# EAGLE design LoRaNow_v0 (EAGLE 9.4.0)
LoRaNow Board V0 This board was design to make easier to connect the Arduino Pro Mini and the LoRa module and runs with 2 AA batteries.
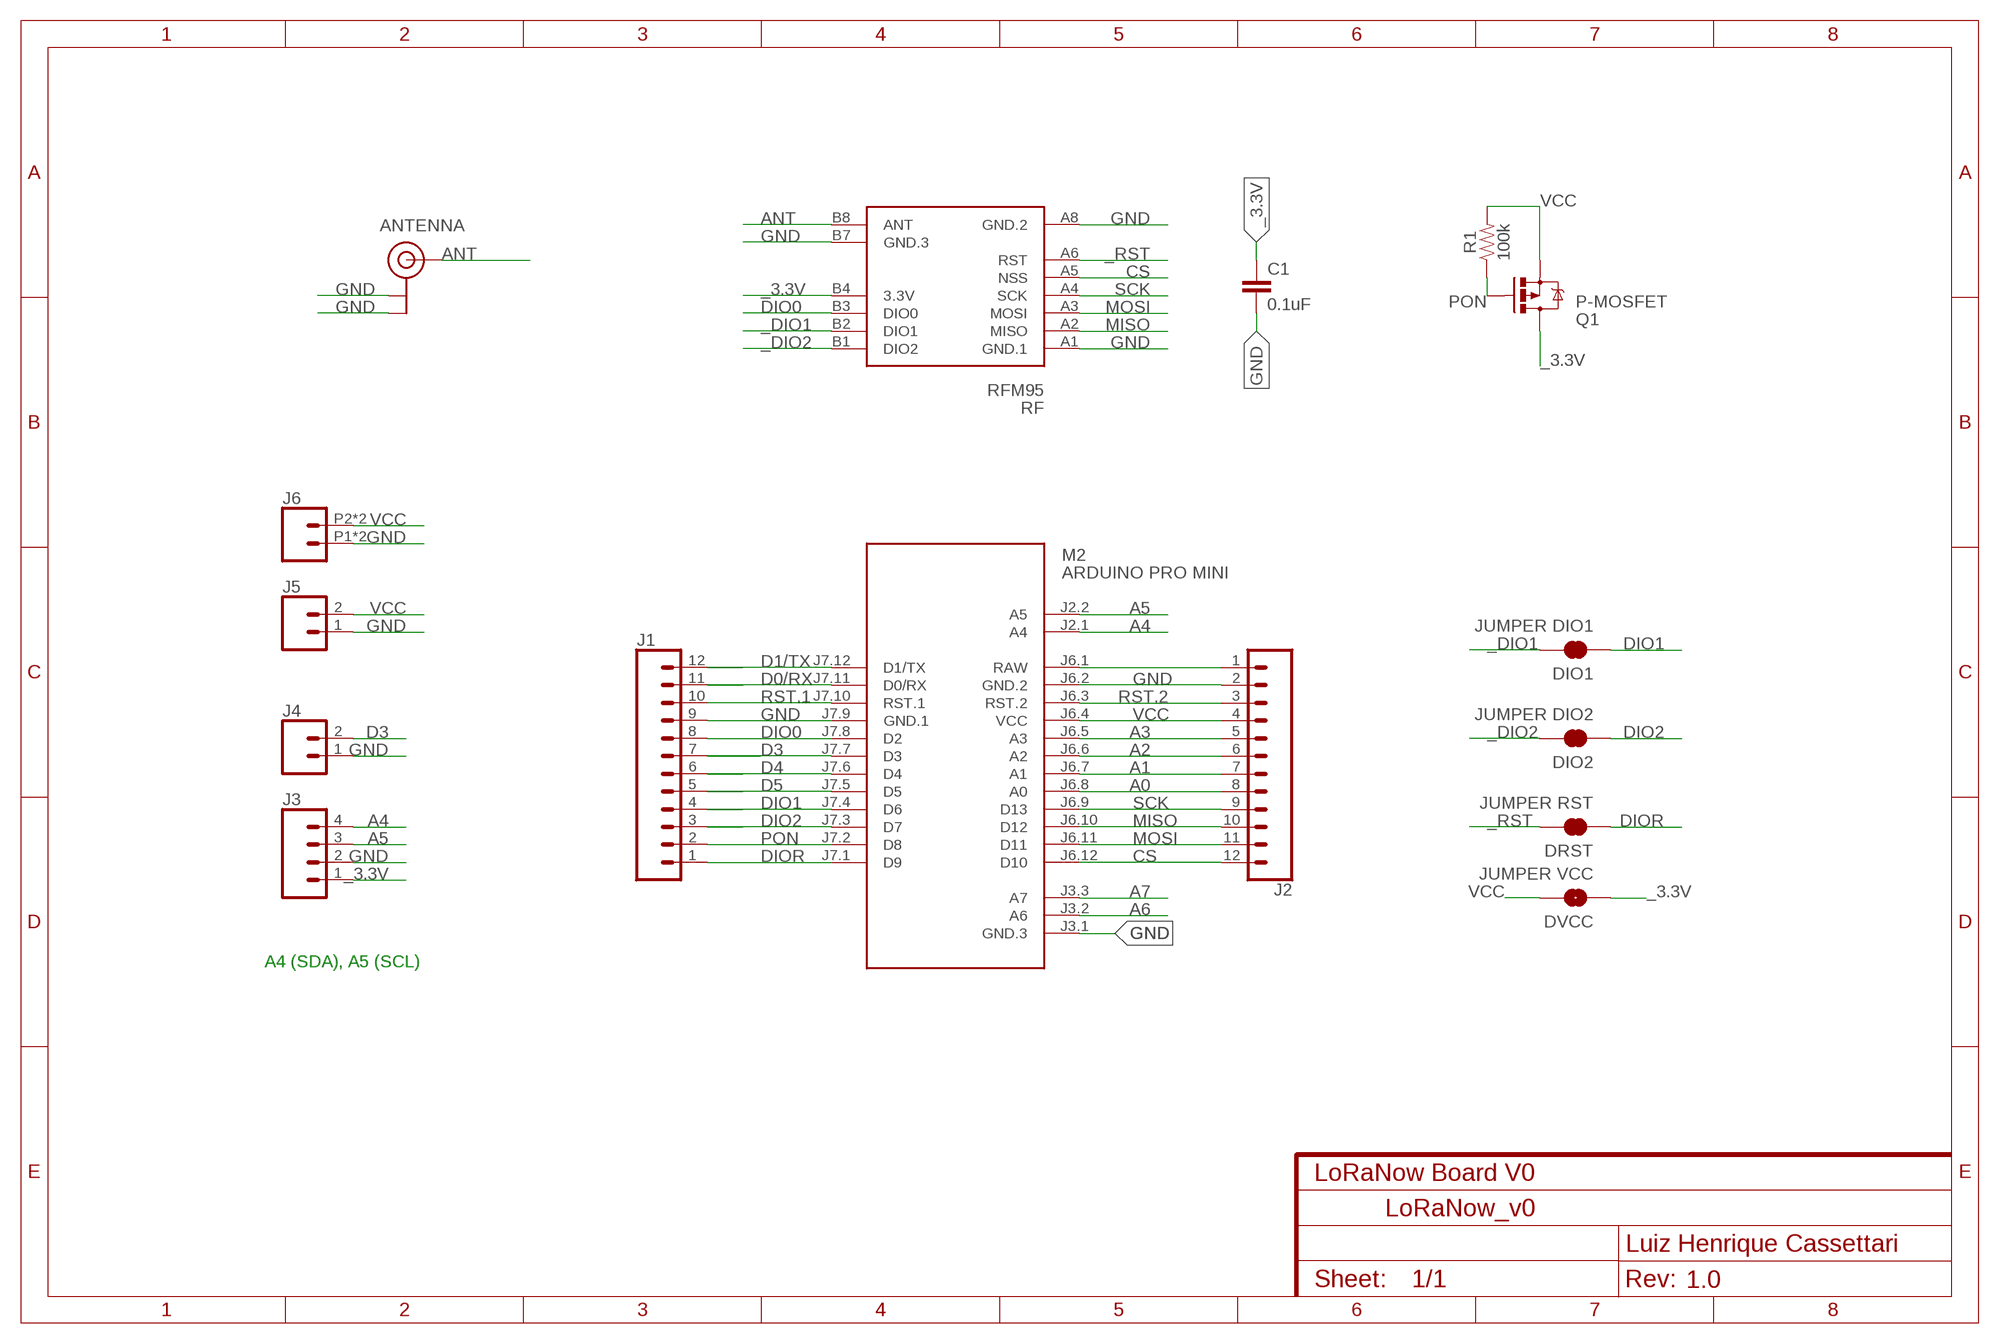
[diagram p0: schematic, sheet 1]
NAME (FRAME-A4L): CNAME: LoRaNow Board V0; CREVISION: 1.0; DESIGNER: Luiz Henrique Cassettari

## Parts
ANTENNA  U.FLU.FL2  [U.FL_2]
C1  0.1uF  C-EUC0603K  [C0603K]
DIO1  JUMPER DIO1  JUMPER-SMT_2_NC_TRACE_NO-SILK  [SMT-JUMPER_2_NC_TRACE_NO-SILK]
DIO2  JUMPER DIO2  JUMPER-SMT_2_NC_TRACE_NO-SILK  [SMT-JUMPER_2_NC_TRACE_NO-SILK]
DRST  JUMPER RST  JUMPER-SMT_2_NC_TRACE_NO-SILK  [SMT-JUMPER_2_NC_TRACE_NO-SILK]
DVCC  JUMPER VCC  JUMPER-SMT_2_NO_NO-SILK  [SMT-JUMPER_2_NO_NO-SILK]
J1  CONN_12NO_SILK  [1X12_NO_SILK]
J2  CONN_12NO_SILK  [1X12_NO_SILK]
J3  CONN_041X04_NO_SILK  [1X04_NO_SILK]
J4  CONN_021X02_NO_SILK  [1X02_NO_SILK]
J5  CONN_021X02_NO_SILK  [1X02_NO_SILK]
J6  CONN_02SMALL_POKEHOME  [1X02_POKEHOME]
M2  ARDUINO PRO MINI  ARDUINO-PRO-MINI-#NP2  [ARDUINO-PRO-MINI#NP#2]
Q1  P-MOSFET  MOSFET-PCHANNELSMD  [SOT23-3]
R1  100k  100KOHM-0603-1/10W-1%  [0603]
RF  RFM95  WIRELESS-LORA-RFM95W-LORANOW  [WIRELESS-LORA-RFM95W#SMD#2]

## Nets
_3.3V: C1.1 DVCC.1 J3.1 Q1.3(D) RF.B4(3.3V)
_DIO1: DIO1.2 RF.B2(DIO1)
_DIO2: DIO2.2 RF.B1(DIO2)
_RST: DRST.2 RF.A6(RST)
A0: J2.8 M2.J6.8(A0)
A1: J2.7 M2.J6.7(A1)
A2: J2.6 M2.J6.6(A2)
A3: J2.5 M2.J6.5(A3)
A4: J3.4 M2.J2.1(A4)
A5: J3.3 M2.J2.2(A5)
A6: M2.J3.2(A6)
A7: M2.J3.3(A7)
ANT: ANTENNA.FEED(SIGNAL) ANTENNA.FEED.P(SIGNAL) RF.B8(ANT)
CS: J2.12 M2.J6.12(D10) RF.A5(NSS)
D0/RX: J1.11 M2.J7.11(D0/RX)
D1/TX: J1.12 M2.J7.12(D1/TX)
D3: J1.7 J4.2 M2.J7.7(D3)
D4: J1.6 M2.J7.6(D4)
D5: J1.5 M2.J7.5(D5)
DIO0: J1.8 M2.J7.8(D2) RF.B3(DIO0)
DIO1: DIO1.1 J1.4 M2.J7.4(D6)
DIO2: DIO2.1 J1.3 M2.J7.3(D7)
DIOR: DRST.1 J1.1 M2.J7.1(D9)
GND: ANTENNA.1(GND) ANTENNA.2(GND) ANTENNA.3(GND) ANTENNA.4(GND) ANTENNA.5(GND) ANTENNA.6(GND) C1.2 J1.9 J2.2 J3.2 J4.1 J5.1 J6.P1 J6.P3 M2.J3.1(GND.3) M2.J6.2(GND.2) M2.J7.9(GND.1) RF.A1(GND.1) RF.A8(GND.2) RF.B7(GND.3)
MISO: J2.10 M2.J6.10(D12) RF.A2(MISO)
MOSI: J2.11 M2.J6.11(D11) RF.A3(MOSI)
PON: J1.2 M2.J7.2(D8) Q1.1(G) R1.1
RAW: J2.1 M2.J6.1(RAW)
RST.1: J1.10 M2.J7.10(RST.1)
RST.2: J2.3 M2.J6.3(RST.2)
SCK: J2.9 M2.J6.9(D13) RF.A4(SCK)
VCC: DVCC.2 J2.4 J5.2 J6.P2 J6.P4 M2.J6.4(VCC) Q1.2(S) R1.2

## Notes on the sheet
- A4 (SDA), A5 (SCL)

## Library data of the parts
ANTENNA = SparkFun-Connectors:U.FL: SMD Antenna Connector - U.FL 2mm height, 3.0mm x 3.0mm receptacle size. SparkFun Products: SparkFun WiFi Shield - ESP8266 <https://www.sparkfun.com/products/13287> SparkFun ESP8266 Thing <https://www.sparkfun.com/products/13231> SparkFun MiniGen - Pro Mini Signal Generator Shield <https://www.sparkfun.com/products/11420>
C1 = rcl:C-EU: CAPACITOR, European symbol; SPICEPREFIX: C
DIO1 DIO2 DRST = SparkFun-Jumpers:JUMPER-SMT_2_NC_TRACE: Normally closed trace jumper This jumper has a trace between two pads so it's normally closed (NC). Use a razor knife to open the connection. For best results follow the IPC guidelines for cutting traces: Cutout at least 0.063 mm (0.005 in). Remove all loose material to clean up the cut area. Seal the cut with an approved epoxy. Reapply solder to reclose the connection.
DVCC = SparkFun-Jumpers:JUMPER-SMT_2_NO: Normally open jumper This jumper has two pads in close proximity to each other. Apply solder to close the connection. Round pads are easier to solder for beginners, but are a lot larger. SparkFun Product that uses the round pads: SparkFun EL Sequencer <https://www.sparkfun.com/products/12781>
J1 J2 = SparkFun-Connectors:CONN_12: Multi connection point. Often used as Generic Header-pin footprint for 0.1 inch spaced/style header connections On any of the 0.1 inch spaced packages, you can populate with these: Break Away Headers - Straight <https://www.sparkfun.com/products/116> (PRT-00116) Break Away Male Headers - Right Angle <https://www.sparkfun.com/products/553> (PRT-00553) Female Headers <https://www.sparkfun.com/products/115> (PRT-00115) Break Away Headers - Machine Pin <https://www.sparkfun.com/products/117> (PRT-00117) Break Away Female Headers - Swiss Machine Pin <https://www.sparkfun.com/products/743> (PRT-00743) For SCREWTERMINALS and SPRING TERMINALS visit here: Screw Terimnals on SparkFun.com <https://www.sparkfun.com/search/results?term=Screw+Terminals> (5mm/3.5mm/2.54mm spacing) This device is also useful as a general connection point to wire up your design to another part of your project. Our various solder wires solder well into these plated through hole pads. Hook-Up Wire - Assortment (Stranded, 22 AWG) <https://www.sparkfun.com/products/11375> (PRT-11375) Hook-Up Wire - Assortment (Solid Core, 22 AWG) <https://www.sparkfun.com/products/11367> (PRT-11367) View the entire wire category on our website here <https://www.sparkfun.com/categories/141> Special notes: Molex polarized connector foot print use with SKU : PRT-08231 with associated crimp pins and housings. 1MM SMD Version SKU: PRT-10208 NOTES ON THE VARIANTS LOCK and LOCK_LONGPADS... This footprint was designed to help hold the alignment of a through-hole component (i.e. 6-pin header) while soldering it into place. You may notice that each hole has been shifted either up or down by 0.005 of an inch from it's more standard position (which is a perfectly straight line). This slight alteration caused the pins (the squares in the middle) to touch the edges of the holes. Because they are alternating, it causes a "brace" to hold the component in place. 0.005 has proven to be the perfect amount of "off-center" position when using our standard breakaway headers. Although looks a little odd when you look at the bare footprint, once you have a header in there, the alteration is very hard to notice. Also,if you push a header all the way into place, it is covered up entirely on the bottom side.
J3 = SparkFun-Connectors:CONN_04: Multi connection point. Often used as Generic Header-pin footprint for 0.1 inch spaced/style header connections On any of the 0.1 inch spaced packages, you can populate with these: Break Away Headers - Straight <https://www.sparkfun.com/products/116> (PRT-00116) Break Away Male Headers - Right Angle <https://www.sparkfun.com/products/553> (PRT-00553) Female Headers <https://www.sparkfun.com/products/115> (PRT-00115) Break Away Headers - Machine Pin <https://www.sparkfun.com/products/117> (PRT-00117) Break Away Female Headers - Swiss Machine Pin <https://www.sparkfun.com/products/743> (PRT-00743) For SCREWTERMINALS and SPRING TERMINALS visit here: Screw Terimnals on SparkFun.com <https://www.sparkfun.com/search/results?term=Screw+Terminals> (5mm/3.5mm/2.54mm spacing) This device is also useful as a general connection point to wire up your design to another part of your project. Our various solder wires solder well into these plated through hole pads. Hook-Up Wire - Assortment (Stranded, 22 AWG) <https://www.sparkfun.com/products/11375> (PRT-11375) Hook-Up Wire - Assortment (Solid Core, 22 AWG) <https://www.sparkfun.com/products/11367> (PRT-11367) View the entire wire category on our website here <https://www.sparkfun.com/categories/141> Special notes: Molex polarized connector foot print use with SKU : PRT-08231 with associated crimp pins and housings. 1MM SMD Version SKU: PRT-10208; PROD_ID: CONN-09696
J4 J5 = SparkFun-Connectors:CONN_02: Multi connection point. Often used as Generic Header-pin footprint for 0.1 inch spaced/style header connections On any of the 0.1 inch spaced packages, you can populate with these: Break Away Headers - Straight <https://www.sparkfun.com/products/116> (PRT-00116) Break Away Male Headers - Right Angle <https://www.sparkfun.com/products/553> (PRT-00553) Female Headers <https://www.sparkfun.com/products/115> (PRT-00115) Break Away Headers - Machine Pin <https://www.sparkfun.com/products/117> (PRT-00117) Break Away Female Headers - Swiss Machine Pin <https://www.sparkfun.com/products/743> (PRT-00743) For SCREWTERMINALS and SPRING TERMINALS visit here: Screw Terimnals on SparkFun.com <https://www.sparkfun.com/search/results?term=Screw+Terminals> (5mm/3.5mm/2.54mm spacing) This device is also useful as a general connection point to wire up your design to another part of your project. Our various solder wires solder well into these plated through hole pads. Hook-Up Wire - Assortment (Stranded, 22 AWG) <https://www.sparkfun.com/products/11375> (PRT-11375) Hook-Up Wire - Assortment (Solid Core, 22 AWG) <https://www.sparkfun.com/products/11367> (PRT-11367) View the entire wire category on our website here <https://www.sparkfun.com/categories/141> Special notes: Molex polarized connector foot print use with: PRT-08233 with associated crimp pins and housings. 2.54_SCREWTERM for use with PRT-10571. 3.5mm Screw Terminal footprints for PRT-08084 5mm Screw Terminal footprints for use with PRT-08432
J6 = SparkFun-Connectors:CONN_02: Multi connection point. Often used as Generic Header-pin footprint for 0.1 inch spaced/style header connections On any of the 0.1 inch spaced packages, you can populate with these: Break Away Headers - Straight <https://www.sparkfun.com/products/116> (PRT-00116) Break Away Male Headers - Right Angle <https://www.sparkfun.com/products/553> (PRT-00553) Female Headers <https://www.sparkfun.com/products/115> (PRT-00115) Break Away Headers - Machine Pin <https://www.sparkfun.com/products/117> (PRT-00117) Break Away Female Headers - Swiss Machine Pin <https://www.sparkfun.com/products/743> (PRT-00743) For SCREWTERMINALS and SPRING TERMINALS visit here: Screw Terimnals on SparkFun.com <https://www.sparkfun.com/search/results?term=Screw+Terminals> (5mm/3.5mm/2.54mm spacing) This device is also useful as a general connection point to wire up your design to another part of your project. Our various solder wires solder well into these plated through hole pads. Hook-Up Wire - Assortment (Stranded, 22 AWG) <https://www.sparkfun.com/products/11375> (PRT-11375) Hook-Up Wire - Assortment (Solid Core, 22 AWG) <https://www.sparkfun.com/products/11367> (PRT-11367) View the entire wire category on our website here <https://www.sparkfun.com/categories/141> Special notes: Molex polarized connector foot print use with: PRT-08233 with associated crimp pins and housings. 2.54_SCREWTERM for use with PRT-10571. 3.5mm Screw Terminal footprints for PRT-08084 5mm Screw Terminal footprints for use with PRT-08432; PROD_ID: CONN-13512
M2 = diy-modules:ARDUINO-PRO-MINI-*#NP: Arduino Pro Mini (and compatible devices) without programming pads More details available here: https://www.arduino.cc/en/Main/ArduinoBoardProMini Click here to find device on ebay.com <http://www.ebay.com/sch/arduino+pro+mini>
Q1 = User-Submitted:MOSFET-PCHANNEL: Generic PMOSFET IRLML2244 - TRANS-11153 (SOT-23 -20V -4.3A) (1.Gate 2.Source 3.Drain) FQP27P06 - COM-10349 <http://www.sparkfun.com/products/10349> (TO-220 -60V -27A) (1.Gate 2.Source 3.Drain)
R1 = SparkFun-Resistors:100KOHM: 100kΩ resistor A resistor is a passive two-terminal electrical component that implements electrical resistance as a circuit element. Resistors act to reduce current flow, and, at the same time, act to lower voltage levels within circuits. - Wikipedia; PROD_ID: RES-07828
RF = diy-modules:WIRELESS-LORA-RFM95W-LORANOW: 868/915 MHz LoRa Radio Transceiver Module based on SX1276 chip Click here to find device on ebay.com <http://www.ebay.com/sch/RFM95W+transceiver>

## Net classes
0 default: clearance 0.205 mm

## Board
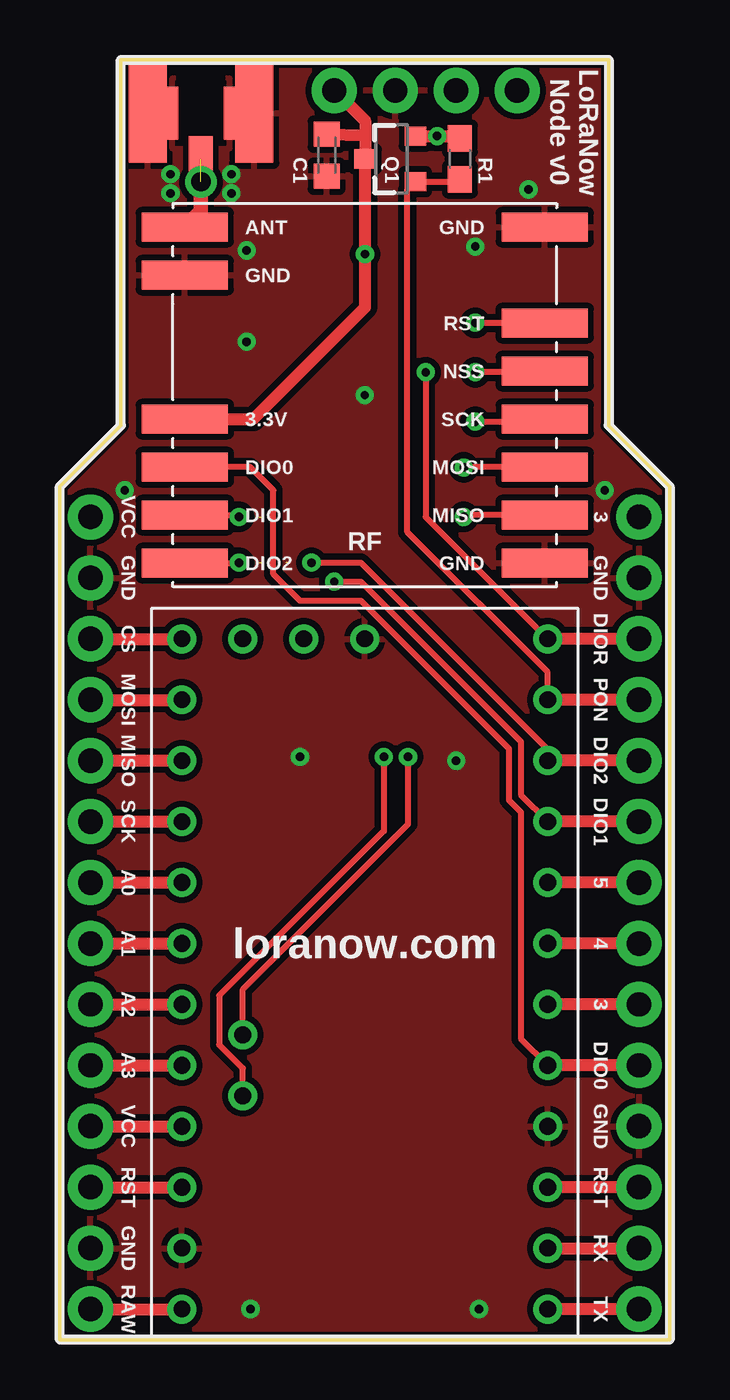
[diagram p1: board, top side]
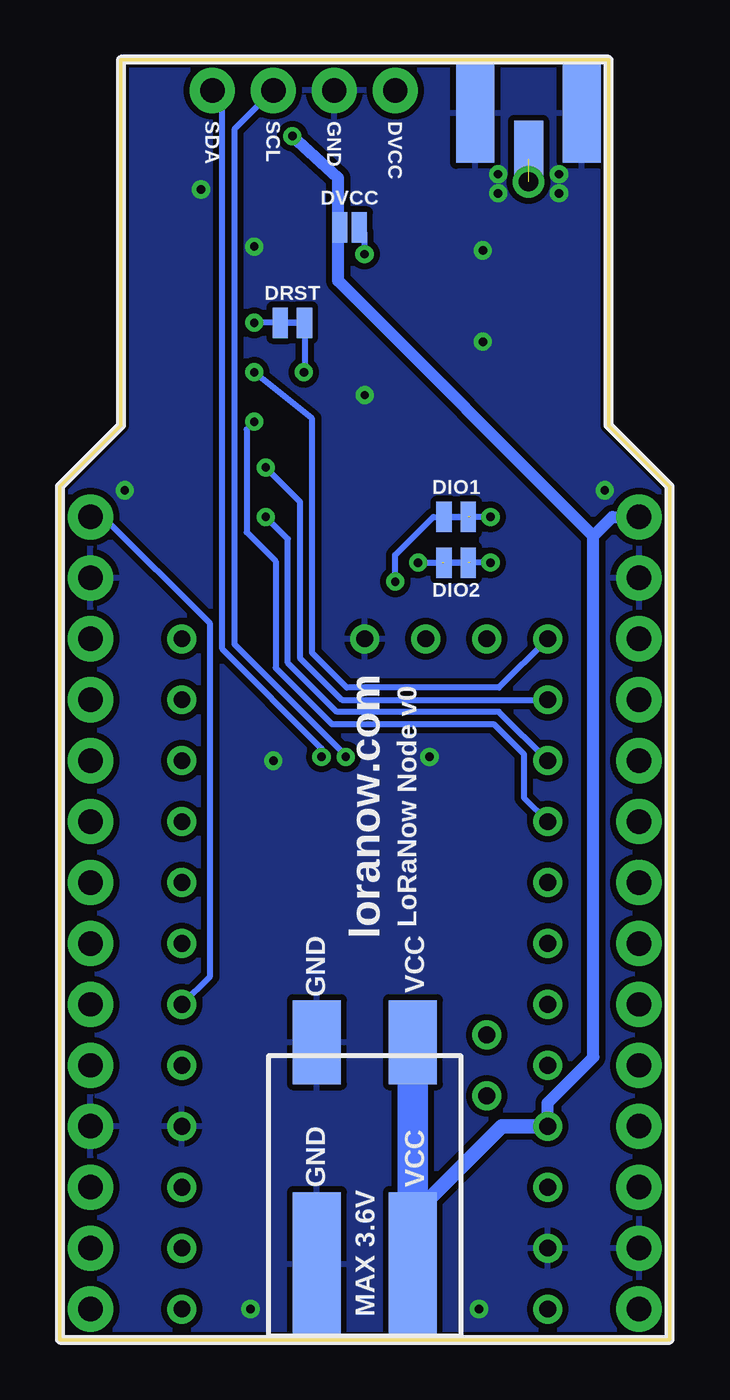
[diagram p2: board, bottom side, seen from below]

Size 25.4 x 53.34 mm. Coordinates in mm from the lower left corner, seen from the top.
Outline: 0,0 0,35.56 2.54,38.1 2.54,53.34 22.86,53.34 22.86,38.1 25.4,35.56 25.4,0 0,0
Copper layers (1*16): Top 0.035mm / dielectric 1.5mm / Bottom 0.035mm
Design rules "JLC_": minimum track width 10mil, minimum drill 0.3mm, track to track 10mil, track to pad 10mil, pad to pad 10mil, via to via 10mil, smd to smd 1mil, copper to edge 1mil, drill to drill 8mil, minimum pad ring 10mil, minimum via ring 8mil, stop-mask expansion 4mil, vias tented up to drill 15mil, thermal gap 10mil

### Footprints (pad centres in the part's own frame; a part is rotated, then mirrored left to right if it is on the bottom)
U.FL_2 = smd 2.203 x 0.476: 1 0,1.191; 2 0,-1.191 | smd 4.128 x 1.587: 3 0,2.223; 4 0,-2.223 | smd 4.128 x 1.587 bottom: 5 0,2.223; 6 0,-2.223 | smd 1.905 x 1: FEED 1.905,0 | smd 2.54 x 1.206 bottom: FEED.B 1.587,0 | drill 0.8: FEED.P 2.857,0
C0603K = smd 1.05 x 1.08: 1 -0.875,0; 2 0.875,0
SMT-JUMPER_2_NC_TRACE_NO-SILK = smd 0.635 x 1.27: 1 -0.508,0; 2 0.508,0
SMT-JUMPER_2_NO_NO-SILK = smd 0.635 x 1.27: 1 -0.406,0; 2 0.406,0
1X12_NO_SILK = drill 1.016 pad 1.88: 1 0,0; 2 2.54,0; 3 5.08,0; 4 7.62,0; 5 10.16,0; 6 12.7,0; 7 15.24,0; 8 17.78,0; 9 20.32,0; 10 22.86,0; 11 25.4,0; 12 27.94,0
1X04_NO_SILK = drill 1.016 pad 1.88: 1 0,0; 2 2.54,0; 3 5.08,0; 4 7.62,0
1X02_NO_SILK = drill 1.016 pad 1.88: 1 0,0; 2 2.54,0
1X02_POKEHOME = smd 3.5 x 2: P1 5.25,2; P2 5.25,-2 | smd 6 x 2: P3 -4,2; P4 -4,-2
ARDUINO-PRO-MINI#NP#2 = drill 0.7: J2.1 -1.27,5.08; J2.2 -3.81,5.08; J3.1 15.24,0; J3.2 15.24,2.54; J3.3 15.24,5.08; J6.1 -12.7,7.62; J6.2 -10.16,7.62; J6.3 -7.62,7.62; J6.4 -5.08,7.62; J6.5 -2.54,7.62; J6.6 0,7.62; J6.7 2.54,7.62; J6.8 5.08,7.62; J6.9 7.62,7.62; J6.10 10.16,7.62; J6.11 12.7,7.62; J6.12 15.24,7.62; J7.1 15.24,-7.62; J7.2 12.7,-7.62; J7.3 10.16,-7.62; J7.4 7.62,-7.62; J7.5 5.08,-7.62; J7.6 2.54,-7.62; J7.7 0,-7.62; J7.8 -2.54,-7.62; J7.9 -5.08,-7.62; J7.10 -7.62,-7.62; J7.11 -10.16,-7.62; J7.12 -12.7,-7.62
SOT23-3 = smd 0.8 x 0.9: 1 -0.95,-1; 2 0.95,-1; 3 0,1.1
0603 = smd 1.1 x 1: 1 -0.85,0; 2 0.85,0
WIRELESS-LORA-RFM95W#SMD#2 = smd 3.6 x 1.2: A1 -7.5,7; A2 -7.5,5; A3 -7.5,3; A4 -7.5,1; A5 -7.5,-1; A6 -7.5,-3; A8 -7.5,-7; B1 7.5,7; B2 7.5,5; B3 7.5,3; B4 7.5,1; B7 7.5,-5; B8 7.5,-7

### Placement (x,y rotation side)
ANTENNA  5.87,51.12 270 top
C1  [C0603K]  11.11,49.37 270 top
DIO1  8.89,34.29 0 bottom
DIO2  8.89,32.38 0 bottom
DRST  15.72,42.39 180 bottom
DVCC  13.34,46.35 180 bottom
J1  24.13,29.21 270 top
J2  1.27,1.27 90 top
J3  11.43,52.07 0 top
J4  24.13,31.75 90 top
J5  1.27,31.75 90 top
J6  12.7,7.14 90 bottom
M2  PRO  [ARDUINO-PRO-MINI#NP#2]  12.7,13.97 90 top
Q1  MOSFET-PCHANNELSMD  [SOT23-3]  13.81,49.21 90 top
R1  16.67,49.21 90 top
RF  LORANOW  [WIRELESS-LORA-RFM95W#SMD#2]  12.7,39.37 180 top

### Tracks (layer width: path | path; a pad name or v marks a point on that pad's centre or on a via)
_3.3V  (via drill 0.35)
  Top 0.254: 4.77,38.42 RF.B4 5.25,38.42
  Top 0.508: J3.1 12.71,50.81 12.71,50.16 | 12.71,50.16 Q1.3 v12.71,45.24 12.71,43.03 8.05,38.37 RF.B4 | C1.1 12.66,50.21 12.71,50.16
  Bottom 0.254: DVCC.1 12.71,46.14 v12.71,45.24
_DIO1  (via drill 0.35)  (1 unrouted)
  Top 0.254: RF.B2 7.38,34.37 v7.46,34.29
  Bottom 0.254: v7.46,34.29 8.31,34.29
_DIO2  (via drill 0.35)  (1 unrouted)
  Top 0.254: RF.B1 7.45,32.37 v7.46,32.38
  Bottom 0.254: v7.46,32.38 8.31,32.38
_RST  (via drill 0.35)
  Top 0.254: RF.A6 17.32,42.37 v17.3,42.39
  Bottom 0.254: DRST.2 v17.3,42.39
A0
  Top 0.508: J2.8 M2.J6.8
A1
  Top 0.508: J2.7 M2.J6.7
A2
  Top 0.508: J2.6 M2.J6.6
A3
  Top 0.508: J2.5 M2.J6.5
A4  (via drill 0.35)
  Top 0.254: M2.J2.1 7.62,14.61 14.5,21.49 v14.5,24.29
  Bottom 0.254: J3.4 18.64,51.66 18.64,28.78 14.5,24.65 v14.5,24.29
A5  (via drill 0.35)
  Top 0.254: M2.J2.2 7.62,11.31 6.63,12.29 6.63,14.34 13.49,21.2 v13.49,24.29
  Bottom 0.254: J3.3 18.13,50.45 18.13,28.99 13.49,24.36 v13.49,24.29
ANT  (1 unrouted)
  Top 0.508: 5.87,46.51 5.73,46.37 RF.B8
  Top 0.61: RF.B8 5.87,47.04 ANTENNA.FEED.P
CS  (via drill 0.35)
  Top 0.254: RF.A5 20.15,40.32 v17.3,40.32
  Top 0.508: J2.12 M2.J6.12
  Bottom 0.254: v17.3,40.32 14.89,38.39 14.89,28.63 13.44,27.18 7.11,27.18 M2.J6.12
D0/RX
  Top 0.508: M2.J7.11 J1.11
D1/TX
  Top 0.508: J1.12 M2.J7.12
D3
  Top 0.508: J1.7 M2.J7.7
  Bottom 0.254: M2.J7.7 19.14,15.14 19.14,29.84 23.59,34.29 J4.2
D4
  Top 0.508: J1.6 M2.J7.6
D5
  Top 0.508: J1.5 M2.J7.5
DIO0
  Top 0.254: RF.B3 6.81,36.53 | 6.81,36.53 | 6.81,36.53 6.97,36.37 7.92,36.37 8.89,35.4 8.89,31.91 10,30.8 12.54,30.8 18.7,24.64 18.7,22.49 19.21,21.98 19.21,12.54 M2.J7.8
  Top 0.508: J1.8 M2.J7.8
DIO1  (via drill 0.35)
  Top 0.254: M2.J7.4 19.21,22.7 19.21,24.92 12.54,31.59 v11.43,31.59
  Top 0.508: J1.4 M2.J7.4
  Bottom 0.254: DIO1.1 9.84,34.29 11.43,32.7 v11.43,31.59
DIO2  (via drill 0.35)  (1 unrouted)
  Top 0.254: v10.48,32.38 12.54,32.38 20.32,24.61 M2.J7.3
  Top 0.508: J1.3 M2.J7.3
  Bottom 0.254: v10.48,32.38 9.47,32.38
DIOR  (via drill 0.35)
  Top 0.254: v15.24,40.32 15.24,34.29 M2.J7.1
  Top 0.508: J1.1 M2.J7.1
  Bottom 0.254: DRST.1 15.21,40.35 v15.24,40.32
GND  (via drill 0.35)
  Top 0.254: 20.06,46.67 RF.A8
  other vias: 4.6,48.58 7.78,41.59 4.6,47.78 7.14,48.58 7.14,47.78 7.78,45.4 17.3,45.56 12.7,39.37 10,24.29 16.51,24.13 7.94,1.27 17.46,1.27 19.53,47.94 22.7,35.4 2.7,35.4
  pour Top (isolate 0.254): 26.19,53.82 26.35,-0.32 -0.32,-0.32 -0.48,53.82
  pour Bottom (isolate 0.254): 26.99,-0.95 -0.95,-0.95 -0.79,54.13 27.15,54.13
MISO  (via drill 0.35)
  Top 0.254: RF.A2 16.91,34.37 v16.83,34.29
  Top 0.508: J2.10 M2.J6.10
  Bottom 0.254: v16.83,34.29 15.91,33.37 15.91,28.21 13.86,26.16 7.11,26.16 M2.J6.10
MOSI  (via drill 0.35)
  Top 0.254: RF.A3 16.84,36.37 v16.83,36.35
  Top 0.508: J2.11 M2.J6.11
  Bottom 0.254: v16.83,36.35 15.4,34.92 15.4,28.42 13.65,26.67 M2.J6.11
PON
  Top 0.254: R1.1 16.41,48.26 Q1.1 14.48,47.93 14.48,33.66 20.32,27.82 M2.J7.2
  Top 0.508: J1.2 M2.J7.2
RAW
  Top 0.508: J2.1 M2.J6.1
RST.1
  Top 0.508: J1.10 M2.J7.10
RST.2
  Top 0.508: J2.3 M2.J6.3
SCK  (via drill 0.35)
  Top 0.254: 5.08,21.91 M2.J6.9 | RF.A4 20.09,38.26 v17.3,38.26
  Top 0.508: J2.9 M2.J6.9
  Bottom 0.254: M2.J6.9 6.07,22.58 6.07,24.41 7.32,25.65 14.07,25.65 16.41,28 16.41,32.45 17.62,33.66 17.62,37.94 v17.3,38.26
VCC  (via drill 0.35)
  Top 0.508: J2.4 M2.J6.4 | Q1.2 15.55,50.16 v15.72,50.16 16.41,50.16 R1.2
  Bottom 0.254: DVCC.2 13.81,46.35
  Bottom 0.508: M2.J6.4 5.08,9.86 3.17,11.76 3.17,33.5 | 3.17,33.5 13.81,44.13 13.81,46.35 13.81,48.42 v15.72,50.16 | 3.17,33.5 2.38,34.29 J5.2
  Bottom 0.61: M2.J6.4 6.99,8.89 10.7,5.17 10.7,3.81 J6.P4
  Bottom 1.27: J6.P2 10.7,3.81

### Text on the board
tPlace: loranow.com
bPlace: LoRaNow Node v0 | loranow.com
tNames: LoRaNow / Node v0 | VCC | 3 | GND | GND | CS | DIOR | MOSI | PON | MISO | DIO2 | SCK | DIO1 | A0 | 5 | A1 | 4 | A2 | 3 | A3 | DIO0 | VCC | GND | RST | RST | GND | RX | RAW | TX
bNames: DVCC | GND | SCL | SDA | VCC | GND | VCC | GND | MAX 3.6V